# EAGLE design walter (EAGLE 9.6.2)
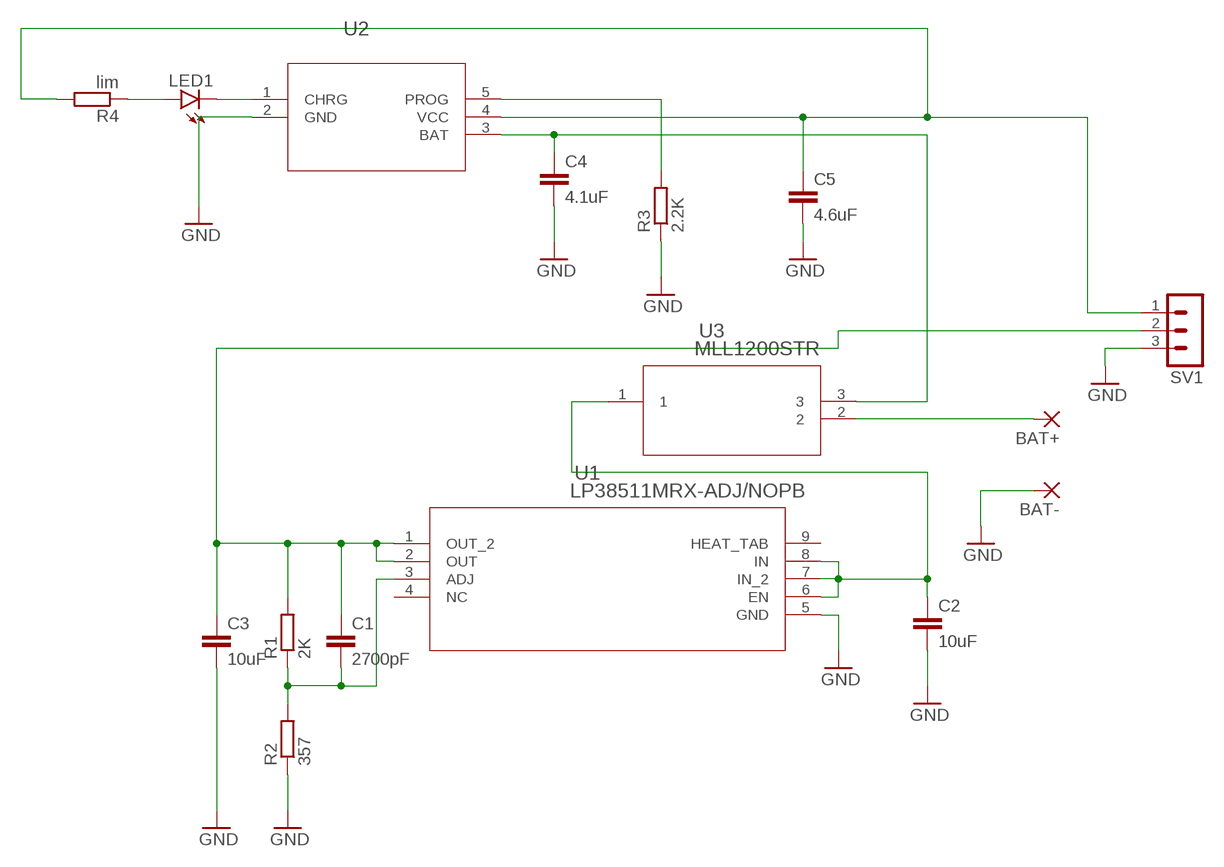
[diagram p0: schematic, sheet 1]

## Parts
BAT+  1,6/0,8  [1,6/0,8]
BAT-  1,6/0,8  [1,6/0,8]
C1  2700pF  C-EUC0402  [C0402]
C2  10uF  C-EUC0603  [C0603]
C3  10uF  C-EUC0603  [C0603]
C4  4.1uF  C-EUC0603  [C0603]
C5  4.6uF  C-EUC0603  [C0603]
LED1  LEDCHIP-LED0603  [CHIP-LED0603]
R1  2K  R-EU_R0402  [R0402]
R2  357  R-EU_R0603  [R0603]
R3  2.2K  R-EU_R0603  [R0603]
R4  lim  R-EU_R0402  [R0402]
SV1  MA03-1  [MA03-1]
U1  LP38511MRX-ADJ/NOPB  [MRA08B_TEX]
U2  LTC4054LES5-4.2TRPBF  [S_5_ADI]
U3  MLL1200STR  [SW_MLL1200STR_TEC]

## Nets
GND: BAT-.1(P) C2.2 C3.2 C4.2 C5.2 R2.1 R3.1 SV1.3 U1.5(GND) U2.2(GND)
N$1: C2.1 U1.6(EN) U1.7(IN_2) U1.8(IN) U3.1
N$2: C4.1 U2.3(BAT) U3.3
N$3: C1.1 C3.1 R1.2 SV1.2 U1.1(OUT_2) U1.2(OUT)
N$4: C1.2 R1.1 R2.2 U1.3(ADJ)
N$5: BAT+.1(P) U3.2
N$6: R3.2 U2.5(PROG)
N$7: C5.1 R4.2 SV1.1 U2.4(VCC)
N$8: LED1.A R4.1
N$9: LED1.C U2.1(CHRG)
Unconnected: U1.4(NC) U1.9(HEAT_TAB)

## Library data of the parts
BAT+ BAT- = wirepad:1,6/0,8: THROUGH-HOLE PAD
C1-C5 = rcl:C-EU: CAPACITOR, European symbol; SPICEPREFIX: C
LED1 = led:LED: LED OSRAM: - CHIPLED LG R971, LG N971, LY N971, LG Q971, LY Q971, LO R971, LY R971 LH N974, LH R974 LS Q976, LO Q976, LY Q976 LO Q996 - Hyper CHIPLED LW Q18S LB Q993, LB Q99A, LB R99A - SideLED LS A670, LO A670, LY A670, LG A670, LP A670 LB A673, LV A673, LT A673, LW A673 LH A674 LY A675 LS A676, LA A676, LO A676, LY A676, LW A676 LS A679, LY A679, LG A679 - Hyper Micro SIDELED® LS Y876, LA Y876, LO Y876, LY Y876 LT Y87S - SmartLED LW L88C, LW L88S LB L89C, LB L89S, LG L890 LS L89K, LO L89K, LY L89K LS L896, LA L896, LO L896, LY L896 - TOPLED LS T670, LO T670, LY T670, LG T670, LP T670 LSG T670, LSP T670, LSY T670, LOP T670, LYG T670 LG T671, LOG T671, LSG T671 LB T673, LV T673, LT T673, LW T673 LH T674 LS T676, LA T676, LO T676, LY T676, LB T676, LH T676, LSB T676, LW T676 LB T67C, LV T67C, LT T67C, LS T67K, LO T67K, LY T67K, LW E67C LS E67B, LA E67B, LO E67B, LY E67B, LB E67C, LV E67C, LT E67C LW T67C LS T679, LY T679, LG T679 LS T770, LO T770, LY T770, LG T770, LP T770 LB T773, LV T773, LT T773, LW T773 LH T774 LS E675, LA E675, LY E675, LS T675 LS T776, LA T776, LO T776, LY T776, LB T776 LHGB T686 LT T68C, LB T68C - Hyper Mini TOPLED® LB M676 - Mini TOPLED Santana® LG M470 LS M47K, LO M47K, LY M47K Source: http://www.osram.convergy.de LUXEON: - LUMILED® LXK2-PW12-R00, LXK2-PW12-S00, LXK2-PW14-U00, LXK2-PW14-V00 LXK2-PM12-R00, LXK2-PM12-S00, LXK2-PM14-U00 LXK2-PE12-Q00, LXK2-PE12-R00, LXK2-PE12-S00, LXK2-PE14-T00, LXK2-PE14-U00 LXK2-PB12-K00, LXK2-PB12-L00, LXK2-PB12-M00, LXK2-PB14-N00, LXK2-PB14-P00, LXK2-PB14-Q00 LXK2-PR12-L00, LXK2-PR12-M00, LXK2-PR14-Q00, LXK2-PR14-R00 LXK2-PD12-Q00, LXK2-PD12-R00, LXK2-PD12-S00 LXK2-PH12-R00, LXK2-PH12-S00 LXK2-PL12-P00, LXK2-PL12-Q00, LXK2-PL12-R00 Source: www.luxeon.com KINGBRIGHT: KA-3528ASYC Source: www.kingbright.com
R1-R4 = rcl:R-EU_: RESISTOR, European symbol; SPICEPREFIX: R
SV1 = con-lstb:MA03-1: PIN HEADER; OC_FARNELL: unknown; OC_NEWARK: unknown
U1 = LP38511MRX-ADJ:NOPB:LP38511MRX-ADJ/NOPB; BUILT_BY: EMA_UL_Team; MANUFACTURER_PART_NUMBER: LP38511MRX-ADJ/NOPB; SOURCELIBRARY: National_2014-06-20; VENDOR: Texas Instruments
U2 = LTC4054:LTC4054LES5-4.2TRPBF; BUILT_BY: EMA_Jessica; COPYRIGHT: Copyright (C) 2016 Accelerated Designs. All rights reserved; MANUFACTURER_PART_NUMBER: LTC4054LES5-4.2#TRPBF; SOURCELIBRARY: Analog_Devices_2018-09-28; VENDOR: Analog Devices Inc
U3 = microswitch:MLL1200STR; BUILT_BY: EMA_Justin; COPYRIGHT: Copyright (C) 2018 Accelerated Designs. All rights reserved; MANUFACTURER_PART_NUMBER: MLL1200STR; SOURCELIBRARY: TE_Connectivity_2019-11-07; VENDOR: TE Connectivity

## Net classes
0 default: width 0.356 mm

## Board
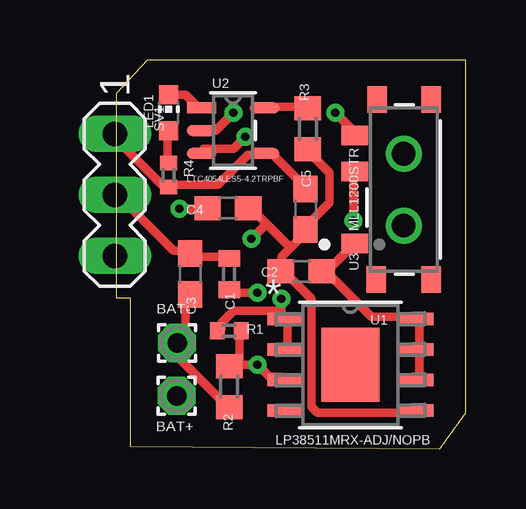
[diagram p1: board, top side]
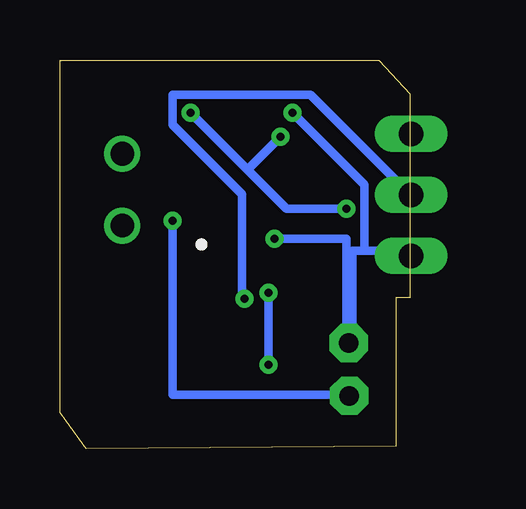
[diagram p2: board, bottom side, seen from below]

Size 14.6 x 16.2 mm. Coordinates in mm from the lower left corner, seen from the top.
Outline: 0.6,0.1 13.5,0 14.6,1.5 14.6,16.2 1.3,16.2 0,14.8 0,6.3 0.6,6.3 0.6,0.1
Copper layers (1*16): Top 0.035mm / dielectric 1.5mm / Bottom 0.035mm
Design rules "default": minimum track width 6mil, minimum drill 0.35mm, track to track 6mil, track to pad 6mil, pad to pad 6mil, via to via 6mil, smd to smd 6mil, copper to edge 40mil, drill to drill 6mil, minimum pad ring 10mil, minimum via ring 8mil, stop-mask expansion 4mil, vias tented up to drill 0mil, thermal gap 10mil

### Footprints (pad centres in the part's own frame; a part is rotated, then mirrored left to right if it is on the bottom)
1,6/0,8 = drill 0.813 pad 1.6 octagon: 1 0,0
C0402 = smd 0.7 x 0.9: 1 -0.65,0; 2 0.65,0
C0603 = smd 1.1 x 1: 1 -0.85,0; 2 0.85,0
CHIP-LED0603 = smd 0.8 x 0.8: A 0,-0.75; C 0,0.75
R0402 = smd 0.6 x 0.7: 1 -0.5,0; 2 0.5,0
R0603 = smd 1 x 1.1: 1 -0.85,0; 2 0.85,0
MA03-1 = drill 1.016 long: 1 -2.54,0; 2 0,0; 3 2.54,0
MRA08B_TEX = smd 1.46 x 0.533: 1 -2.724,1.905; 2 -2.724,0.635; 3 -2.724,-0.635; 4 -2.724,-1.905; 5 2.724,-1.905; 6 2.724,-0.635; 7 2.724,0.635; 8 2.724,1.905 | smd 2.413 x 3.099: 9 0,0
S_5_ADI = smd 1.219 x 0.457: 1 -1.31,0.95; 2 -1.31,0; 3 -1.31,-0.95; 4 1.31,-0.95; 5 1.31,0.95
SW_MLL1200STR_TEC = smd 0.813 x 1.092: 1 -2.25,2.046; 2 0.75,2.046; 3 2.25,2.046 | smd 1.092 x 0.813: 4 -3.75,1.143; 5 3.75,1.102; 6 -3.75,-1.144; 7 3.75,-1.144 | drill 0.991 pad 0.991: 8 -1.499,0; 9 1.499,0

### Placement (x,y rotation side)
BAT+  2.53,2.21 0 top
BAT-  2.55,4.41 0 top
C1  4.72,7.28 270 top
C2  7.73,7.4 180 top
C3  3.1,7.28 270 top
C4  4.67,10.02 0 top
C5  7.9,9.98 270 top
LED1  2.2,14 0 top
R1  4.72,4.92 180 top
R2  4.72,2.59 90 top
R3  8,13.34 90 top
R4  2.2,11.4 270 top
SV1  -0.05,10.58 270 top
U1  9.78,3.5 0 top
U2  4.88,13.26 0 top
U3  12,10.8 90 top

### Tracks (layer width: path | path; a pad name or v marks a point on that pad's centre or on a via)
GND  (via drill 0.35)
  Top 0.356: R2.1 4.65,1.75 2.65,3.75 2.65,4.25 BAT-.1 2.9,3.75 2.9,6.25 C3.2 | v4.9,14 4.15,13.25 3.65,13.25 U2.2 | 6.9,7.5 6.9,8 7.28,8.38 | 7.28,8.38 7.9,9 C5.2 7.9,9.25 8.9,10.25 8.9,11.5 8.15,12.25 R3.1 | 7.28,8.38 6.28,9.38 | 6.28,9.38 5.65,10 C4.2 | 6.9,7.5 8.15,6.25 8.15,1.75 8.4,1.5 12.4,1.5 U1.5 | 6.9,7.5 C2.2 | 6.28,9.38 v5.65,8.75
  Bottom 0.356: v4.9,14 1.9,11 1.9,8.25 | 1.9,8.25 0.15,8.25 SV1.3 | 1.9,8.25 2.4,8.25 2.4,4.5 BAT-.1 2.65,4.5 2.65,8.75 v5.65,8.75
N$1
  Top 0.356: U3.1 9.9,8.5 8.65,7.25 C2.1 8.9,7.25 10.65,5.5 12.4,5.5 U1.8 12.65,5.25 12.65,4.25 U1.7 12.65,4 12.65,3 U1.6
N$2  (via drill 0.35)
  Top 0.356: v9.15,14 9.9,13.25 U3.3 | v2.65,10 3.65,10 C4.1 | v5.4,13 4.9,12.5 3.65,12.5 U2.3
  Bottom 0.356: 6.78,11.62 5.15,10 v2.65,10 | 6.78,11.62 v9.15,14 | 6.78,11.62 v5.4,13
N$3  (via drill 0.35)
  Top 0.356: 6.78,5.62 6.9,5.5 U1.1 7.15,5.25 7.15,4.25 U1.2 | 6.78,5.62 6.65,5.75 4.9,5.75 4.4,5.25 4.4,5 R1.2 | C1.1 4.65,8 3.15,8 C3.1 2.9,8.25 2.4,8.25 0.15,10.5 SV1.2 | v6.9,6.25 6.9,5.75 6.78,5.62
  Bottom 0.356: v6.9,6.25 7,6.35 7,10.6 9.9,13.5 9.9,14.75 4.15,14.75 0.15,10.75 SV1.2
N$4  (via drill 0.35)
  Top 0.356: R1.1 5.15,4.75 5.15,3.75 4.9,3.5 R2.2 5.15,3.5 v5.9,3.5 6.4,3 6.9,3 U1.3 | v5.9,6.5 4.9,6.5 C1.2
  Bottom 0.356: v5.9,3.5 v5.9,6.5
N$5  (via drill 0.35)
  Top 0.356: v9.9,9.5 9.9,11.5 U3.2
  Bottom 0.356: v9.9,9.5 9.9,2.25 2.65,2.25 BAT+.1
N$6
  Top 0.356: R3.2 7.9,14.25 6.4,14.25 U2.5
N$7
  Top 0.356: C5.1 7.9,10.9 6.5,12.3 6.49,12.31 U2.4 6.13,12.25 5.5,12.25 4.25,11 2.4,11 R4.2 2.15,11 1.9,11 -0.1,13 SV1.1
N$8
  Top 0.356: R4.1 2.15,12 2.15,13.25 LED1.A
N$9
  Top 0.356: LED1.C 2.9,14.75 3.4,14.25 U2.1